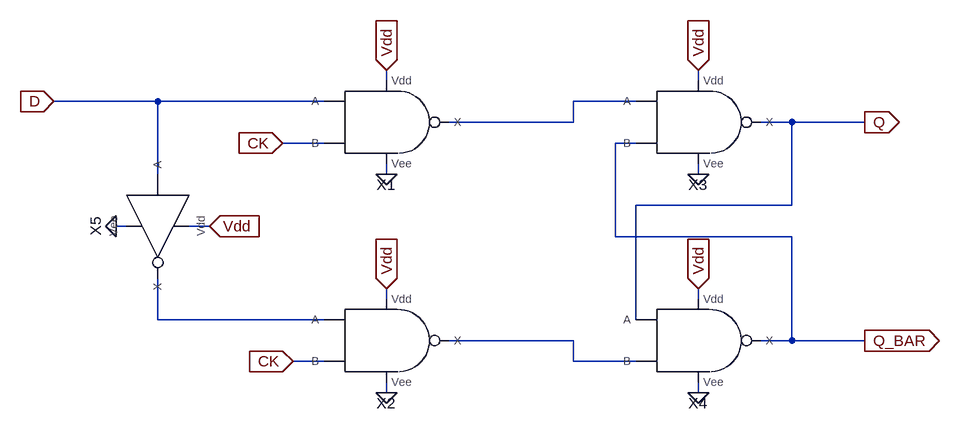
[diagram p0: schematic Draft9.asc]
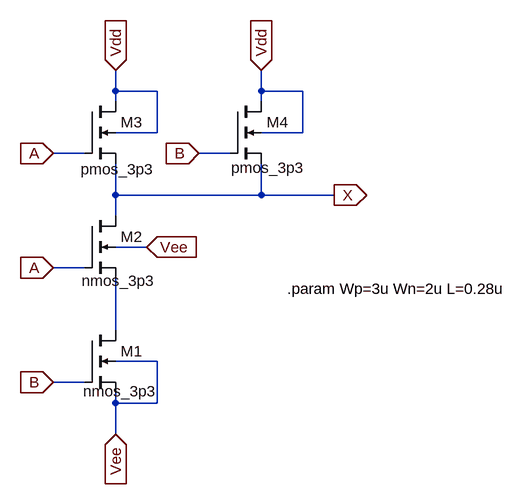
[diagram p1: sub-circuit nand2x1.asc]
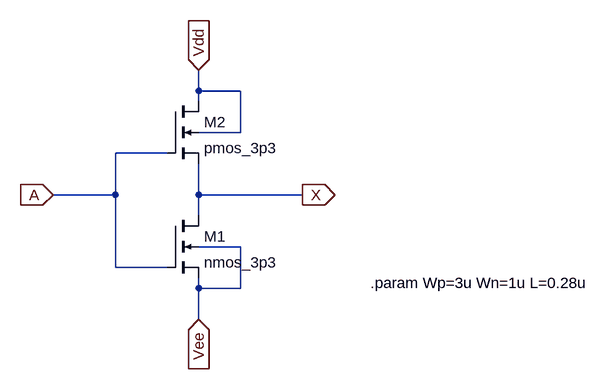
[diagram p2: sub-circuit invx1.asc]
Draft9.asc, the LTspice schematic file:
Version 4
SHEET 1 1084 680
WIRE 208 16 208 0
WIRE 688 16 688 0
WIRE -144 48 -304 48
WIRE 112 48 -144 48
WIRE 592 48 496 48
WIRE 496 80 496 48
WIRE 496 80 304 80
WIRE 832 80 784 80
WIRE 944 80 832 80
WIRE 112 112 48 112
WIRE 592 112 560 112
WIRE -144 160 -144 48
WIRE 208 160 208 144
WIRE 688 160 688 144
WIRE 832 208 832 80
WIRE 832 208 592 208
WIRE -192 240 -208 240
WIRE -64 240 -96 240
WIRE 560 256 560 112
WIRE 832 256 560 256
WIRE 208 352 208 336
WIRE 688 352 688 336
WIRE -144 384 -144 320
WIRE 112 384 -144 384
WIRE 592 384 592 208
WIRE 496 416 304 416
WIRE 832 416 832 256
WIRE 832 416 784 416
WIRE 944 416 832 416
WIRE 112 448 64 448
WIRE 496 448 496 416
WIRE 592 448 496 448
WIRE 208 496 208 480
WIRE 688 496 688 480
FLAG 208 0 Vdd
IOPIN 208 0 In
FLAG 208 160 0
FLAG 208 336 Vdd
IOPIN 208 336 In
FLAG 208 496 0
FLAG 688 0 Vdd
IOPIN 688 0 In
FLAG 688 160 0
FLAG 688 336 Vdd
IOPIN 688 336 In
FLAG 688 496 0
FLAG -64 240 Vdd
IOPIN -64 240 In
FLAG -208 240 0
FLAG -304 48 D
IOPIN -304 48 In
FLAG 944 80 Q
IOPIN 944 80 Out
FLAG 944 416 Q_BAR
IOPIN 944 416 Out
FLAG 48 112 CK
IOPIN 48 112 In
FLAG 64 448 CK
IOPIN 64 448 In
SYMBOL NAND2x1 208 80 R0
SYMATTR InstName X1
SYMBOL NAND2x1 208 416 R0
SYMATTR InstName X2
SYMBOL NAND2x1 688 80 R0
SYMATTR InstName X3
SYMBOL NAND2x1 688 416 R0
SYMATTR InstName X4
SYMBOL INVx1 -144 240 R90
SYMATTR InstName X5

nand2x1.asc, the sub-circuit schematic file:
Version 4.1
SHEET 1 900 680
WIRE -96 32 -96 0
WIRE -32 32 -96 32
WIRE 128 32 128 0
WIRE 192 32 128 32
WIRE -96 48 -96 32
WIRE 128 48 128 32
WIRE -32 96 -32 32
WIRE -32 96 -96 96
WIRE 192 96 192 32
WIRE 192 96 128 96
WIRE -144 128 -192 128
WIRE 80 128 32 128
WIRE -96 192 -96 144
WIRE 128 192 128 144
WIRE 128 192 -96 192
WIRE 240 192 128 192
WIRE -96 224 -96 192
WIRE -48 272 -96 272
WIRE -144 304 -192 304
WIRE -96 400 -96 320
WIRE -32 448 -96 448
WIRE -144 480 -192 480
WIRE -96 512 -96 496
WIRE -32 512 -32 448
WIRE -32 512 -96 512
WIRE -96 560 -96 512
FLAG -96 0 Vdd
IOPIN -96 0 In
FLAG -192 128 A
IOPIN -192 128 In
FLAG 240 192 X
IOPIN 240 192 Out
FLAG 128 0 Vdd
IOPIN 128 0 In
FLAG -192 304 A
IOPIN -192 304 In
FLAG -192 480 B
IOPIN -192 480 In
FLAG 32 128 B
IOPIN 32 128 In
FLAG -96 560 Vee
IOPIN -96 560 In
FLAG -48 272 Vee
IOPIN -48 272 In
SYMBOL nmos4 -144 400 R0
WINDOW 3 -2 94 Left 2
SYMATTR Value nmos_3p3
SYMATTR InstName M1
SYMATTR Value2 l={L} w={Wn}
SYMBOL nmos4 -144 48 R0
WINDOW 3 -6 104 Left 2
SYMATTR Value pmos_3p3
SYMATTR InstName M3
SYMATTR Value2 l={L} w={Wp}
SYMBOL nmos4 80 48 R0
WINDOW 3 2 102 Left 2
SYMATTR Value pmos_3p3
SYMATTR InstName M4
SYMATTR Value2 l={L} w={Wp}
SYMBOL nmos4 -144 224 R0
WINDOW 3 -4 100 Left 2
SYMATTR Value nmos_3p3
SYMATTR InstName M2
SYMATTR Value2 l={L} w={Wn}
TEXT 168 336 Left 2 !.param Wp=3u Wn=2u L=0.28u

invx1.asc, the sub-circuit schematic file:
Version 4.1
SHEET 1 2776 836
WIRE 416 -16 416 -48
WIRE 480 -16 416 -16
WIRE 416 0 416 -16
WIRE 480 48 480 -16
WIRE 480 48 416 48
WIRE 368 80 288 80
WIRE 288 144 288 80
WIRE 288 144 192 144
WIRE 416 144 416 96
WIRE 576 144 416 144
WIRE 416 176 416 144
WIRE 480 224 416 224
WIRE 288 256 288 144
WIRE 368 256 288 256
WIRE 416 288 416 272
WIRE 480 288 480 224
WIRE 480 288 416 288
WIRE 416 336 416 288
FLAG 416 -48 Vdd
IOPIN 416 -48 In
FLAG 192 144 A
IOPIN 192 144 In
FLAG 576 144 X
IOPIN 576 144 Out
FLAG 416 336 Vee
IOPIN 416 336 In
SYMBOL nmos4 368 176 R0
SYMATTR InstName M1
SYMATTR Value nmos_3p3
SYMATTR Value2 l={L} w={Wn}
SYMBOL nmos4 368 0 R0
SYMATTR InstName M2
SYMATTR Value pmos_3p3
SYMATTR Value2 l={L} w={Wp}
TEXT 680 280 Left 2 !.param Wp=3u Wn=1u L=0.28u

The netlist it stands for:
* Draft9.asc
XX1 D CK Vdd N001 0 nand2x1
XX2 N002 CK Vdd N003 0 nand2x1
XX3 N001 Q_BAR Vdd Q 0 nand2x1
XX4 Q N003 Vdd Q_BAR 0 nand2x1
XX5 D Vdd N002 0 invx1

* block symbol definitions
.subckt nand2x1 A B Vdd X Vee
M1 N001 B Vee Vee nmos_3p3 l={L} w={Wn}
M3 Vdd A X Vdd pmos_3p3 l={L} w={Wp}
M4 Vdd B X Vdd pmos_3p3 l={L} w={Wp}
M2 X A N001 Vee nmos_3p3 l={L} w={Wn}
.param Wp=3u Wn=2u L=0.28u
.ends nand2x1

.subckt invx1 A Vdd X Vee
M1 X A Vee Vee nmos_3p3 l={L} w={Wn}
M2 Vdd A X Vdd pmos_3p3 l={L} w={Wp}
.param Wp=3u Wn=1u L=0.28u
.ends invx1

.model NMOS NMOS
.model PMOS PMOS
.lib standard.mos
.backanno
.end